# Altium schematic sheet 04_FPGA_core.SchDoc
size OrCAD B
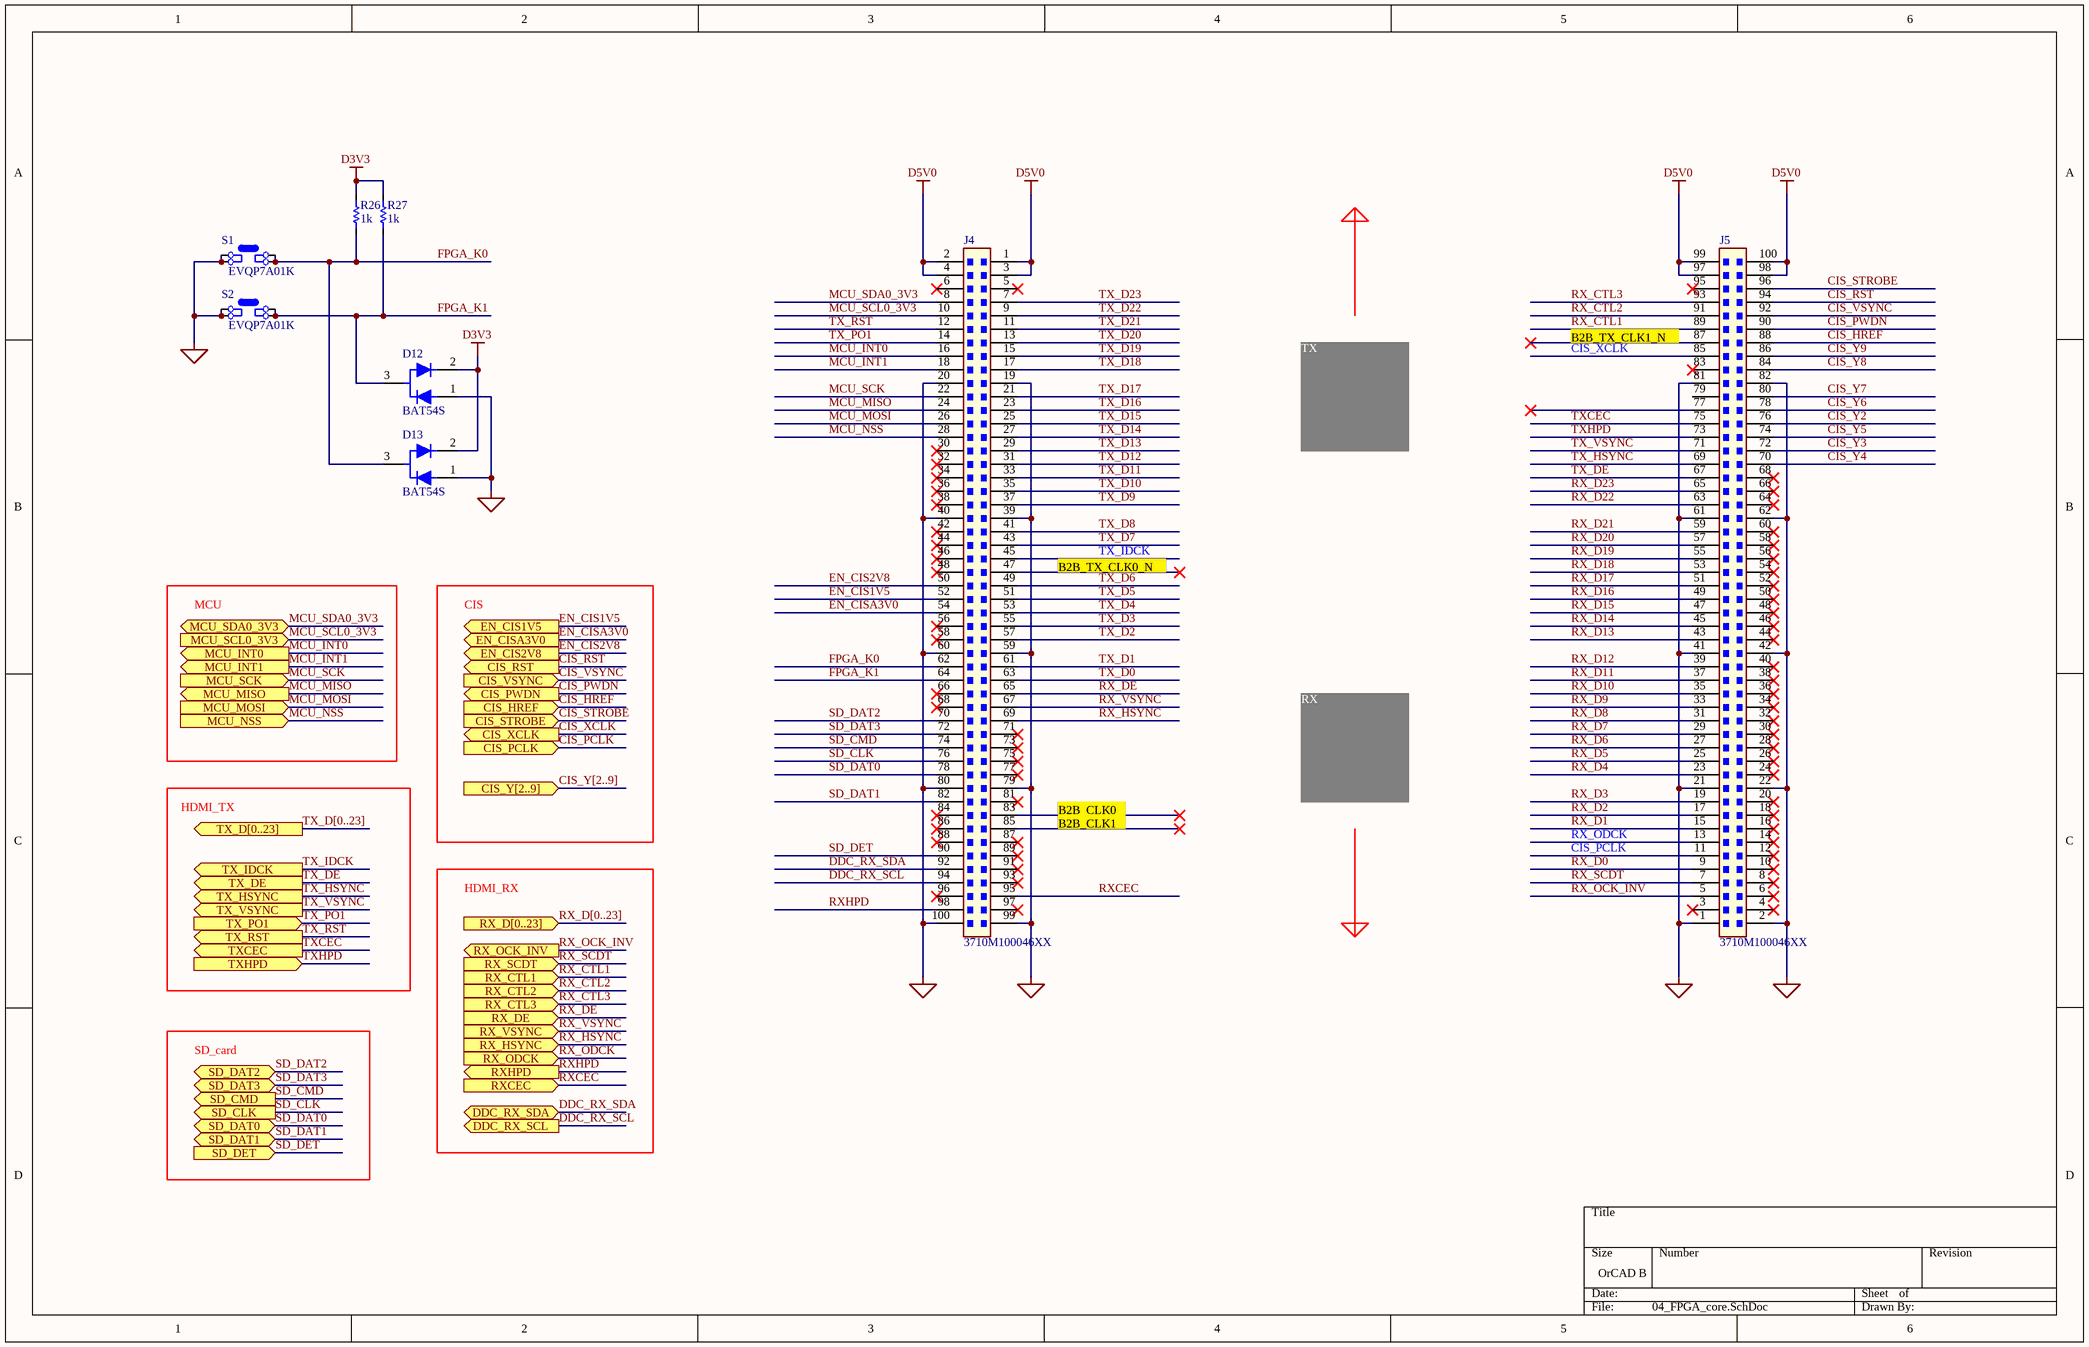
[diagram p0: 04_FPGA_core.SchDoc]

## Parts
D12  BAT54S  [SOT95P230X110-3N_SOT23_BAT54]
D13  BAT54S  [SOT95P230X110-3N_SOT23_BAT54]
J4  3710M100046XX  [3710M100046XX]
J5  3710M100046XX  [3710M100046XX]
R26  1k  [R0402]
R27  1k  [R0402]
S1  EVQP7A01K  [EVQP7A01K]
S2  EVQP7A01K  [EVQP7A01K]

## Ports
CIS_HREF (in), CIS_PCLK (in), CIS_PWDN (out), CIS_RST (out), CIS_STROBE (in), CIS_VSYNC (in), CIS_XCLK (out), CIS_Y[2..9] (in), DDC_RX_SCL (out), DDC_RX_SDA (bidir), EN_CIS1V5 (out), EN_CIS2V8 (out), EN_CISA3V0 (out), MCU_INT0 (out), MCU_INT1 (out), MCU_MISO (out), MCU_MOSI (in), MCU_NSS (in), MCU_SCK (in), MCU_SCL0_3V3 (in), MCU_SDA0_3V3 (bidir), RX_CTL1 (in), RX_CTL2 (in), RX_CTL3 (in), RX_D[0..23] (in), RX_DE (in), RX_HSYNC (in), RX_OCK_INV (out), RX_ODCK (in), RX_SCDT (in), RX_VSYNC (in), RXCEC (in), RXHPD (out), SD_CLK (out), SD_CMD (out), SD_DAT0 (bidir), SD_DAT1 (bidir), SD_DAT2 (bidir), SD_DAT3 (bidir), SD_DET (in), TX_D[0..23] (out), TX_DE (out), TX_HSYNC (out), TX_IDCK (out), TX_PO1 (in), TX_RST (out), TX_VSYNC (out), TXCEC (out), TXHPD (in)

## Nets
D3V3: D12.2 D13.2 R26.2 R27.2
D5V0: J4.1 J4.2 J4.3 J4.4 J5.97 J5.98 J5.99 J5.100
GND: D12.1 D13.1 J4.19 J4.20 J4.39 J4.40 J4.59 J4.60 J4.79 J4.80 J4.99 J4.100 J5.1 J5.2 J5.21 J5.22 J5.41 J5.42 J5.61 J5.62 J5.81 J5.82 S1.1(CVdd) S2.1(CVdd)
CIS_HREF: J5.88 ; port CIS_HREF
CIS_PCLK: J5.11 ; port CIS_PCLK
CIS_PWDN: J5.90 ; port CIS_PWDN
CIS_RST: J5.94 ; port CIS_RST
CIS_STROBE: J5.96 ; port CIS_STROBE
CIS_VSYNC: J5.92 ; port CIS_VSYNC
CIS_XCLK: J5.85 ; port CIS_XCLK
CIS_Y2: J5.76
CIS_Y3: J5.72
CIS_Y4: J5.70
CIS_Y5: J5.74
CIS_Y6: J5.78
CIS_Y7: J5.80
CIS_Y8: J5.84
CIS_Y9: J5.86
DDC_RX_SCL: J4.94 ; port DDC_RX_SCL
DDC_RX_SDA: J4.92 ; port DDC_RX_SDA
EN_CIS1V5: J4.52 ; port EN_CIS1V5
EN_CIS2V8: J4.50 ; port EN_CIS2V8
EN_CISA3V0: J4.54 ; port EN_CISA3V0
FPGA_K0: D13.3 J4.62 R26.1 S1.2(CVdd)
FPGA_K1: D12.3 J4.64 R27.1 S2.2(CVdd)
MCU_INT0: J4.16 ; port MCU_INT0
MCU_INT1: J4.18 ; port MCU_INT1
MCU_MISO: J4.24 ; port MCU_MISO
MCU_MOSI: J4.26 ; port MCU_MOSI
MCU_NSS: J4.28 ; port MCU_NSS
MCU_SCK: J4.22 ; port MCU_SCK
MCU_SCL0_3V3: J4.10 ; port MCU_SCL0_3V3
MCU_SDA0_3V3: J4.8 ; port MCU_SDA0_3V3
RX_CTL1: J5.89 ; port RX_CTL1
RX_CTL2: J5.91 ; port RX_CTL2
RX_CTL3: J5.93 ; port RX_CTL3
RX_D0: J5.9
RX_D1: J5.15
RX_D2: J5.17
RX_D3: J5.19
RX_D4: J5.23
RX_D5: J5.25
RX_D6: J5.27
RX_D7: J5.29
RX_D8: J5.31
RX_D9: J5.33
RX_D10: J5.35
RX_D11: J5.37
RX_D12: J5.39
RX_D13: J5.43
RX_D14: J5.45
RX_D15: J5.47
RX_D16: J5.49
RX_D17: J5.51
RX_D18: J5.53
RX_D19: J5.55
RX_D20: J5.57
RX_D21: J5.59
RX_D22: J5.63
RX_D23: J5.65
RX_DE: J4.65 ; port RX_DE
RX_HSYNC: J4.69 ; port RX_HSYNC
RX_OCK_INV: J5.5 ; port RX_OCK_INV
RX_ODCK: J5.13 ; port RX_ODCK
RX_SCDT: J5.7 ; port RX_SCDT
RX_VSYNC: J4.67 ; port RX_VSYNC
RXCEC: J4.95 ; port RXCEC
RXHPD: J4.98 ; port RXHPD
SD_CLK: J4.76 ; port SD_CLK
SD_CMD: J4.74 ; port SD_CMD
SD_DAT0: J4.78 ; port SD_DAT0
SD_DAT1: J4.82 ; port SD_DAT1
SD_DAT2: J4.70 ; port SD_DAT2
SD_DAT3: J4.72 ; port SD_DAT3
SD_DET: J4.90 ; port SD_DET
TX_D0: J4.63
TX_D1: J4.61
TX_D2: J4.57
TX_D3: J4.55
TX_D4: J4.53
TX_D5: J4.51
TX_D6: J4.49
TX_D7: J4.43
TX_D8: J4.41
TX_D9: J4.37
TX_D10: J4.35
TX_D11: J4.33
TX_D12: J4.31
TX_D13: J4.29
TX_D14: J4.27
TX_D15: J4.25
TX_D16: J4.23
TX_D17: J4.21
TX_D18: J4.17
TX_D19: J4.15
TX_D20: J4.13
TX_D21: J4.11
TX_D22: J4.9
TX_D23: J4.7
TX_DE: J5.67 ; port TX_DE
TX_HSYNC: J5.69 ; port TX_HSYNC
TX_IDCK: J4.45 ; port TX_IDCK
TX_PO1: J4.14 ; port TX_PO1
TX_RST: J4.12 ; port TX_RST
TX_VSYNC: J5.71 ; port TX_VSYNC
TXCEC: J5.75 ; port TXCEC
TXHPD: J5.73 ; port TXHPD

Not connected (* = marked no-connect by the designer): J4 5(4)* 6(5)* 30* 32* 34* 36* 38* 42* 44* 46* 47* 48* 56* 58* 66* 68* 71* 73* 75* 77* 81* 83* 84* 85* 86* 87* 88* 89* 91* 93* 96* 97*; J5 3(2)* 4(3)* 6(5)* 8(7)* 10(9)* 12* 14* 16* 18* 20* 24* 26* 28* 30* 32* 34* 36* 38* 40* 44* 46* 48* 50* 52* 54* 56* 58* 60* 64* 66* 68* 77* 79 83* 87* 95*

## Buses and harness runs
bus CIS_Y[2..9] = port CIS_Y[2..9]
bus RX_D[0..23] = port RX_D[0..23]
bus TX_D[0..23] = port TX_D[0..23]

## Notes on the sheet
- TX
- (near J5) B2B_TX_CLK1_N
- MCU
- CIS
- B2B_TX_CLK0_N
- RX
- HDMI_TX
- B2B_CLK0
- B2B_CLK1
- HDMI_RX
- SD_card

## Library data of the parts
D12 D13 = BAT54S: Schottky Double Diodes,30V,200mA,SOT23,a1k2k1a2; Manufacturer1: NXP; Manufacturer2: *; PartNumberManufacturer1: BAT54S; PartNumberManufacturer2: *; UnitPrice: *
J4 J5 = 3710M100046XX: B2B male,100Pin,Vertical,0.8mm Pitch,SMD; Manufacturer1: JK; Manufacturer2: *; PartNumberManufacturer1: 3710M100046XX; PartNumberManufacturer2: *; UnitPrice: *
R26 R27 = RES011: RES,1k,1%,1/16W,0402; PartNumberManufacturer2: *; Manufacturer2: *; PartNumberManufacturer1: *; UnitPrice: *; Manufacturer1: *; Value: 1k
S1 S2 = EVQP7A01K: Switch,3.5x2.9,Normal open,SMD; Manufacturer1: Panasonic; Manufacturer2: *; PartNumberManufacturer2: *; PartNumberManufacturer1: EVQP7A01K; UnitPrice: *